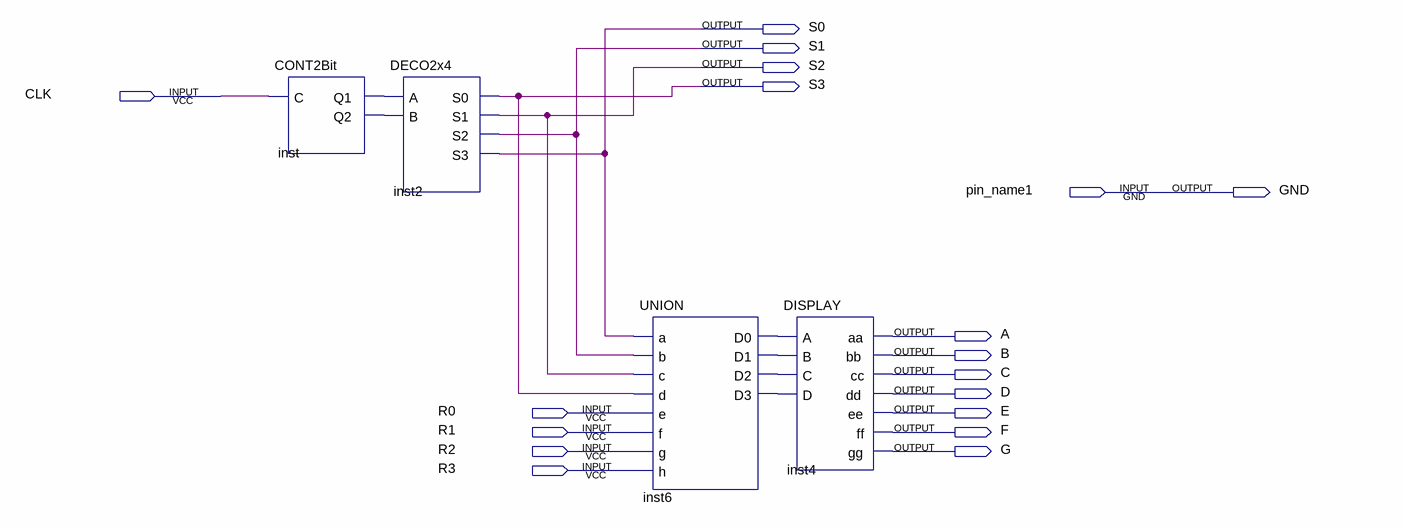
[diagram p0: schematic sheet]
// Quartus schematic CONTROL3.bdf as structural Verilog: 4 symbols, 18 pins
module CONTROL3 (
  input  CLK,
  input  pin_name1,
  input  R0,
  input  R1,
  input  R2,
  input  R3,
  output S0,
  output S1,
  output S2,
  output S3,
  output GND,
  output A,
  output B,
  output C,
  output D,
  output E,
  output F,
  output G
);

  wire inst6_d0, inst6_d1, inst6_d2, inst6_d3, inst_q1, inst_q2;

  CONT2Bit inst (.C(CLK), .Q1(inst_q1), .Q2(inst_q2));
  DECO2x4 inst2 (.A(inst_q1), .B(inst_q2), .S0(S3), .S1(S2), .S2(S1), .S3(S0));
  UNION inst6 (
    .a(S0), .b(S1), .c(S2), .d(S3), .e(R0), .f(R1), .g(R2), .h(R3), .D0(inst6_d0), .D1(inst6_d1),
    .D2(inst6_d2), .D3(inst6_d3));
  DISPLAY inst4 (
    .A(inst6_d0), .B(inst6_d1), .C(inst6_d2), .D(inst6_d3), .aa(A), .bb(B), .cc(C), .dd(D), .ee(E), .ff(F),
    .gg(G));

  assign GND = pin_name1;
endmodule
